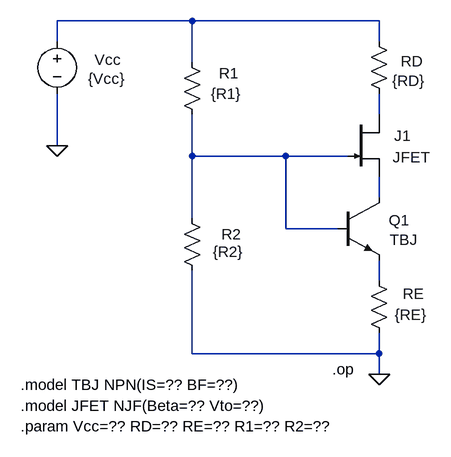
[diagram p0: schematic COMB02opFig.asc]
COMB02opFig.asc, the LTspice schematic file:
Version 4
SHEET 1 1608 1076
WIRE 896 -96 688 -96
WIRE 1184 -96 896 -96
WIRE 688 -64 688 -96
WIRE 1184 -64 1184 -96
WIRE 896 -32 896 -96
WIRE 1184 48 1184 16
WIRE 688 96 688 16
WIRE 896 112 896 48
WIRE 1040 112 896 112
WIRE 1136 112 1040 112
WIRE 1184 176 1184 144
WIRE 896 208 896 112
WIRE 1040 224 1040 112
WIRE 1120 224 1040 224
WIRE 1184 304 1184 272
WIRE 896 416 896 288
WIRE 1184 416 1184 384
WIRE 1184 416 896 416
WIRE 1184 448 1184 416
FLAG 1184 448 0
FLAG 688 96 0
SYMBOL njf 1136 48 R0
WINDOW 0 71 33 Left 2
WINDOW 3 69 66 Left 2
SYMATTR InstName J1
SYMATTR Value JFET
SYMBOL res 1168 -80 R0
WINDOW 0 49 46 Left 2
SYMATTR InstName RD
SYMATTR Value {RD}
SYMBOL voltage 688 -80 R0
WINDOW 123 0 0 Left 0
WINDOW 39 0 0 Left 0
WINDOW 0 58 44 Left 2
WINDOW 3 48 73 Left 2
SYMATTR InstName Vcc
SYMATTR Value {Vcc}
SYMBOL npn 1120 176 R0
WINDOW 0 79 35 Left 2
WINDOW 3 80 65 Left 2
SYMATTR InstName Q1
SYMATTR Value TBJ
SYMBOL res 1168 288 R0
WINDOW 0 52 36 Left 2
WINDOW 3 40 68 Left 2
SYMATTR InstName RE
SYMATTR Value {RE}
SYMBOL res 880 -48 R0
WINDOW 0 57 33 Left 2
WINDOW 3 45 64 Left 2
SYMATTR InstName R1
SYMATTR Value {R1}
SYMBOL res 880 192 R0
WINDOW 0 61 40 Left 2
WINDOW 3 48 67 Left 2
SYMATTR InstName R2
SYMATTR Value {R2}
TEXT 1112 440 Left 2 !.op
TEXT 632 496 Left 2 !.model JFET NJF(Beta=?? Vto=??)
TEXT 632 528 Left 2 !.param Vcc=?? RD=?? RE=?? R1=?? R2=??
TEXT 632 464 Left 2 !.model TBJ NPN(IS=?? BF=??)

The netlist it stands for:
* COMB02opFig.asc
J1 N002 N003 N004 JFET
RD N001 N002 {RD}
Vcc N001 0 {Vcc}
Q1 N004 N003 N005 0 TBJ
RE N005 0 {RE}
R1 N001 N003 {R1}
R2 N003 0 {R2}
.model NPN NPN
.model PNP PNP
.lib standard.bjt
.model NJF NJF
.model PJF PJF
.lib standard.jft
.op
.model JFET NJF(Beta=?? Vto=??)
.param Vcc=?? RD=?? RE=?? R1=?? R2=??
.model TBJ NPN(IS=?? BF=??)
.backanno
.end